# EAGLE design Tengu v10 (EAGLE 7.5.0)
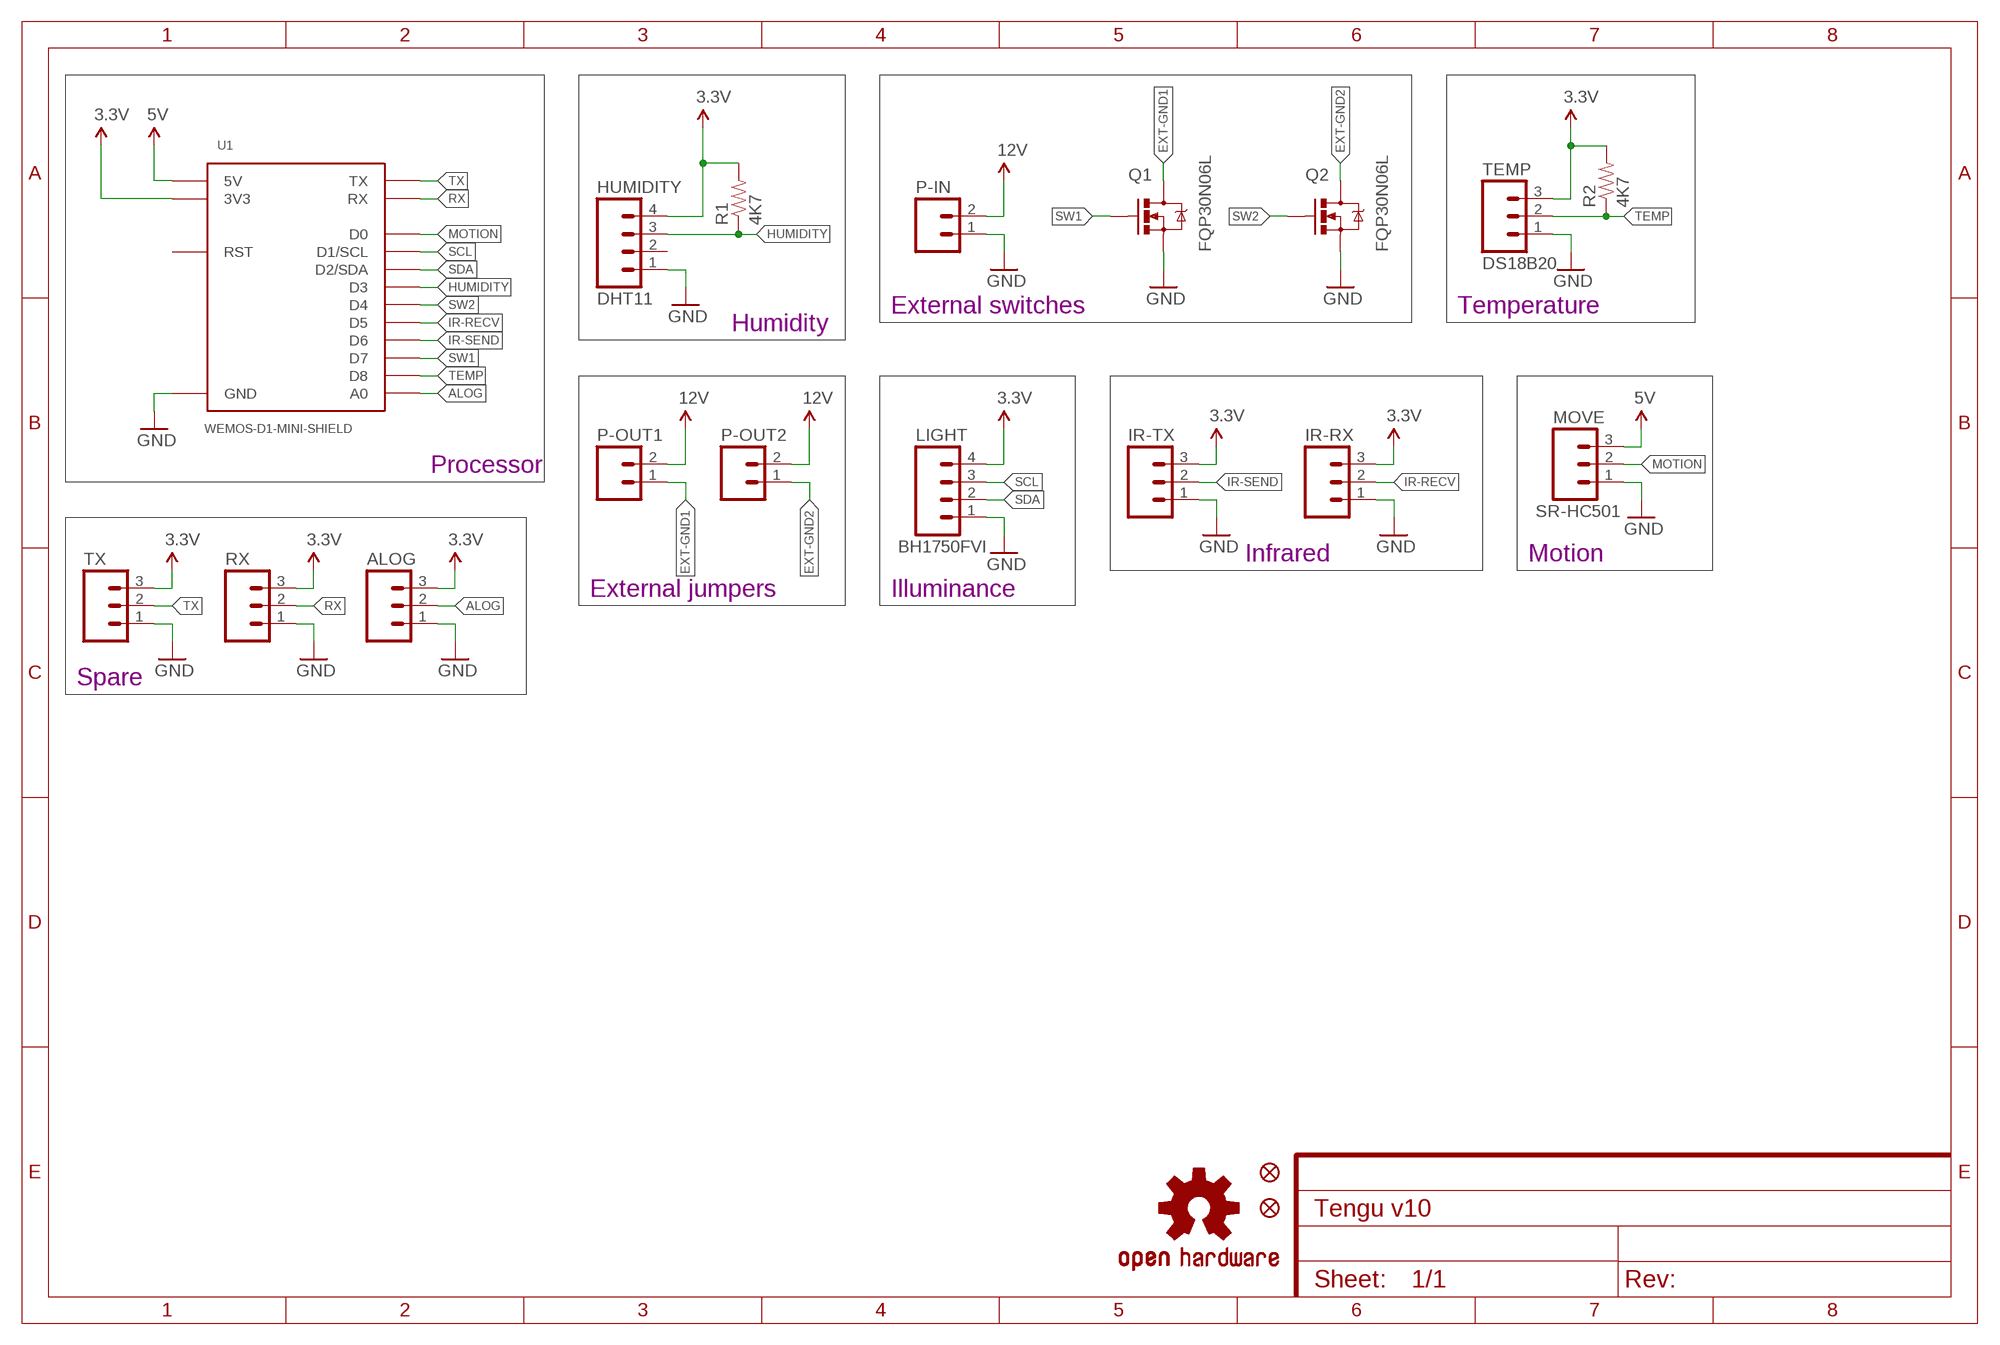
[diagram p0: schematic, sheet 1, part 1 of 2]
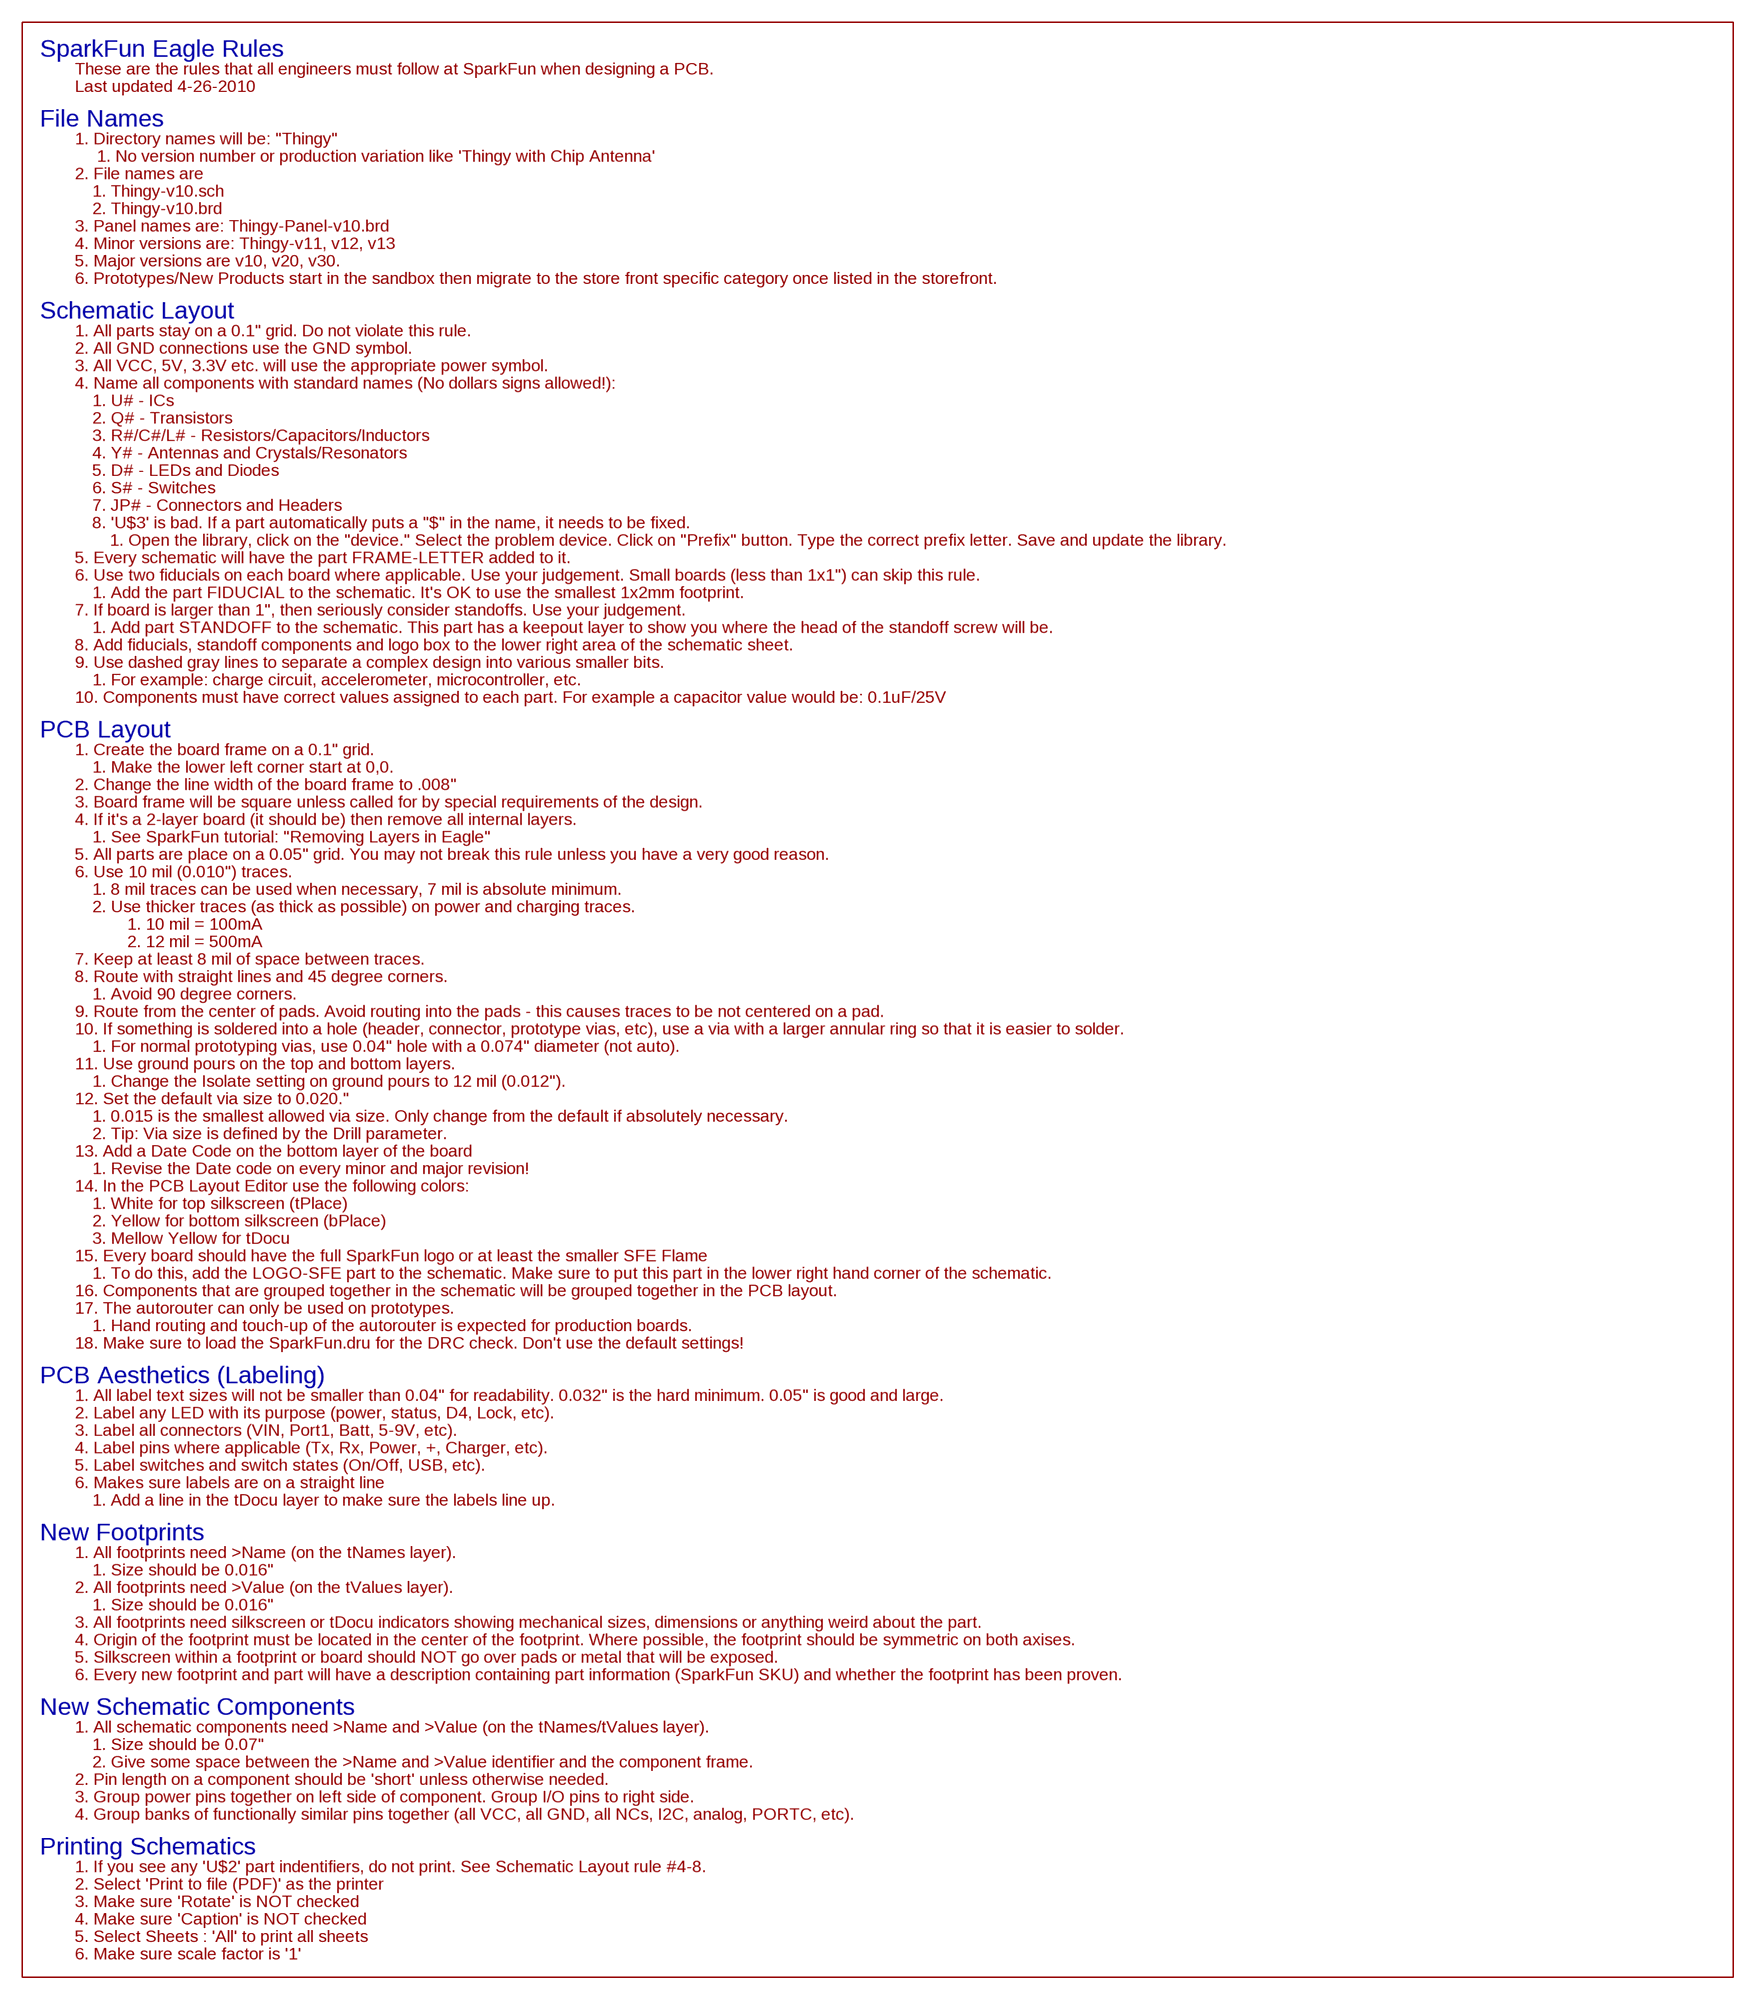
[diagram p1: schematic, sheet 1, part 2 of 2]

## Parts
ALOG  M03PTH  [1X03]
FD1  FIDUCIAL1X2  [FIDUCIAL-1X2]
FD2  FIDUCIAL1X2  [FIDUCIAL-1X2]
HUMIDITY  DHT11  M04PTH  [1X04]
IR-RX  M03PTH  [1X03]
IR-TX  M03PTH  [1X03]
LIGHT  BH1750FVI  M04PTH  [1X04]
LOGO1  OSHW-LOGOM  [OSHW-LOGO-M]
MOVE  SR-HC501  M03PTH  [1X03]
P-IN  M02PTH3  [1X02_LONGPADS]
P-OUT1  M02PTH3  [1X02_LONGPADS]
P-OUT2  M02PTH3  [1X02_LONGPADS]
Q1  FQP30N06L  MOSFET-NCHANNELFQP30N06L  [TO220V]
Q2  FQP30N06L  MOSFET-NCHANNELFQP30N06L  [TO220V]
R1  4K7  RESISTOR1206  [1206]
R2  4K7  RESISTOR1206  [1206]
RX  M03PTH  [1X03]
TEMP  DS18B20  M03PTH  [1X03]
TX  M03PTH  [1X03]
U1  WEMOS-D1-MINI-SHIELD  [WEMOS-D1-MINI-SHIELD]

## Nets
3.3V: ALOG.3 HUMIDITY.4 IR-RX.3 IR-TX.3 LIGHT.4 R1.2 R2.2 RX.3 TEMP.3 TX.3 U1.3V3
5V: MOVE.3 U1.5V
12V: P-IN.2 P-OUT1.2 P-OUT2.2
ALOG: ALOG.2 U1.A0
EXT-GND1: P-OUT1.1 Q1.2(D)
EXT-GND2: P-OUT2.1 Q2.2(D)
GND: ALOG.1 HUMIDITY.1 IR-RX.1 IR-TX.1 LIGHT.1 MOVE.1 P-IN.1 Q1.3(S) Q2.3(S) RX.1 TEMP.1 TX.1 U1.GND
HUMIDITY: HUMIDITY.3 R1.1 U1.D3
IR-RECV: IR-RX.2 U1.D5
IR-SEND: IR-TX.2 U1.D6
MOTION: MOVE.2 U1.D0
RX: RX.2 U1.RX
SCL: LIGHT.3 U1.D1(D1/SCL)
SDA: LIGHT.2 U1.D2(D2/SDA)
SW1: Q1.1(G) U1.D7
SW2: Q2.1(G) U1.D4
TEMP: R2.1 TEMP.2 U1.D8
TX: TX.2 U1.TX
Unconnected: HUMIDITY.2 U1.RST

## Notes on the sheet
- External switches | Temperature
- Humidity
- Processor
- Infrared | Motion
- External jumpers | Illuminance
- Spare

## Library data of the parts
ALOG IR-RX IR-TX MOVE RX TEMP TX = SparkFun-Connectors:M03: Header 3 Standard 3-pin 0.1" header. Use with straight break away headers (SKU : PRT-00116), right angle break away headers (PRT-00553), swiss pins (PRT-00743), machine pins (PRT-00117), and female headers (PRT-00115). Molex polarized connector foot print use with SKU : PRT-08232 with associated crimp pins and housings.
FD1 FD2 = SparkFun-Aesthetics:FIDUCIAL: Fiducial Alignment Points Various fiducial points for machine vision alignment.
HUMIDITY LIGHT = SparkFun-Connectors:M04: Header 4 Standard 4-pin 0.1" header. Use with straight break away headers (SKU : PRT-00116), right angle break away headers (PRT-00553), swiss pins (PRT-00743), machine pins (PRT-00117), and female headers (PRT-00115). Molex polarized connector foot print use with SKU : PRT-08231 with associated crimp pins and housings. 1MM SMD Version SKU: PRT-10208; PROD_ID: CONN-09696
LOGO1 = SparkFun-Aesthetics:OSHW-LOGO: Open Source Hardware Logo This logo indicates the piece of hardware it is found on incorporates a OSHW license and/or adheres to the definition of open source hardware found here: http://freedomdefined.org/OSHW
P-IN P-OUT1 P-OUT2 = SparkFun-Connectors:M02: Standard 2-pin 0.1" header. Use with - straight break away headers ( PRT-00116) - right angle break away headers (PRT-00553) - swiss pins (PRT-00743) - machine pins (PRT-00117) - female headers (PRT-00115) Molex polarized connector foot print use with: PRT-08233 with associated crimp pins and housings. 2.54_SCREWTERM for use with PRT-10571. 3.5mm Screw Terminal footprints for PRT-08084 5mm Screw Terminal footprints for use with PRT-08432
Q1 Q2 = SparkFun-DiscreteSemi:MOSFET-NCHANNEL: Common NMOSFET Parts MFG P/N Store ID Prod ID FDD8780 TRANS-09984 SI7820DN TRANS-11055 FDS6630A IC-08089 2N7002PW TRANS-11151 FQP30N06L COM-10213 TRANS-10060 BSS123LT1G TRANS-08345 BSS138 TRANS-00830 BS170 2N7000; PROD_ID: TRANS-10060
R1 R2 = SparkFun-Resistors:RESISTOR: Resistor Basic schematic elements and footprints for 0603, 1206, and PTH resistors.
U1 = WemosMini:WEMOS-D1-MINI-SHIELD

## Board
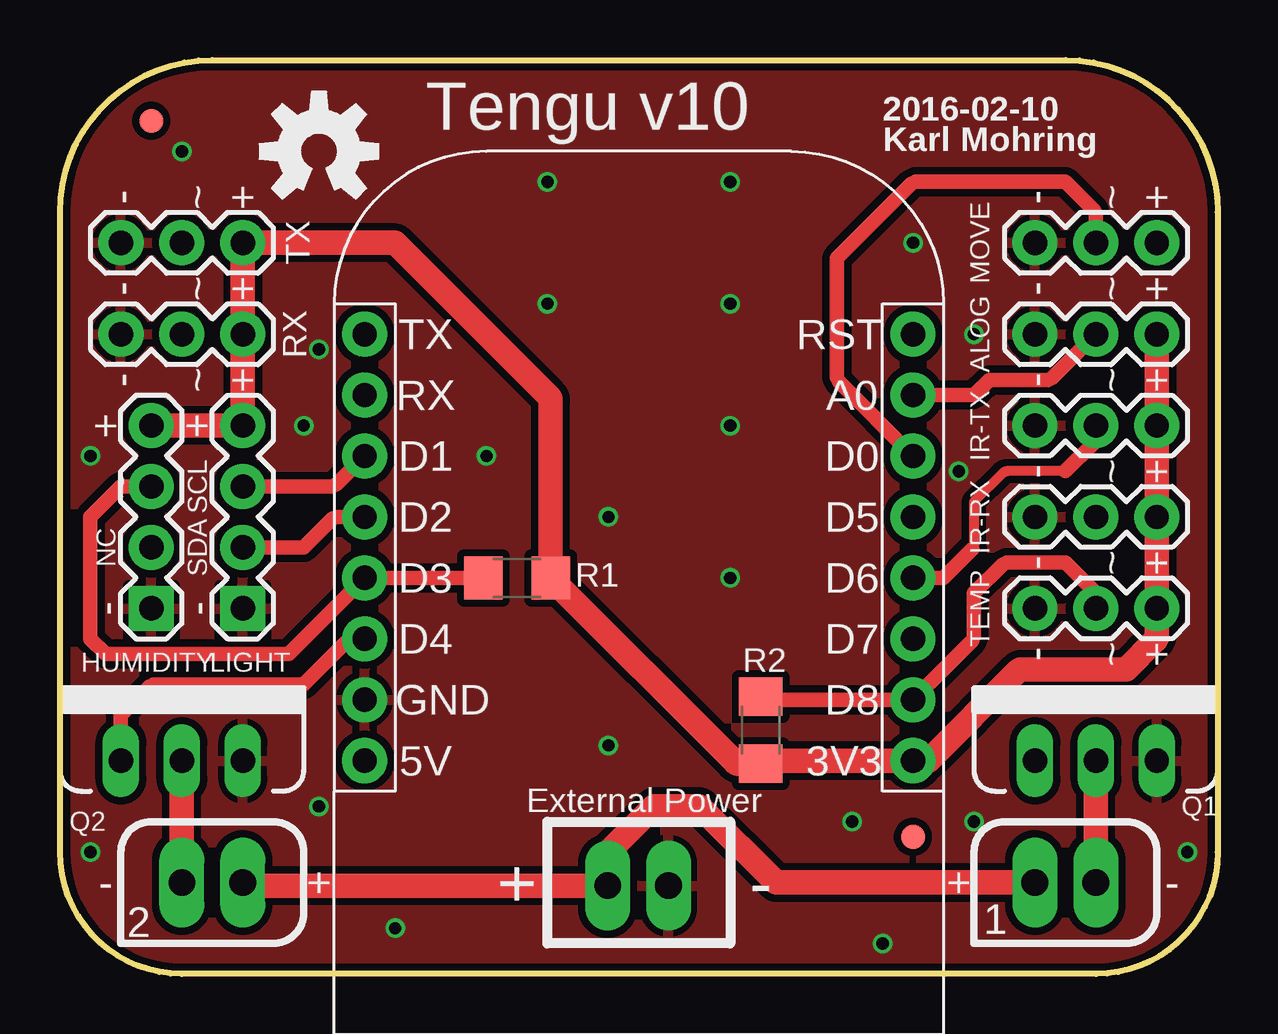
[diagram p2: board, top side]
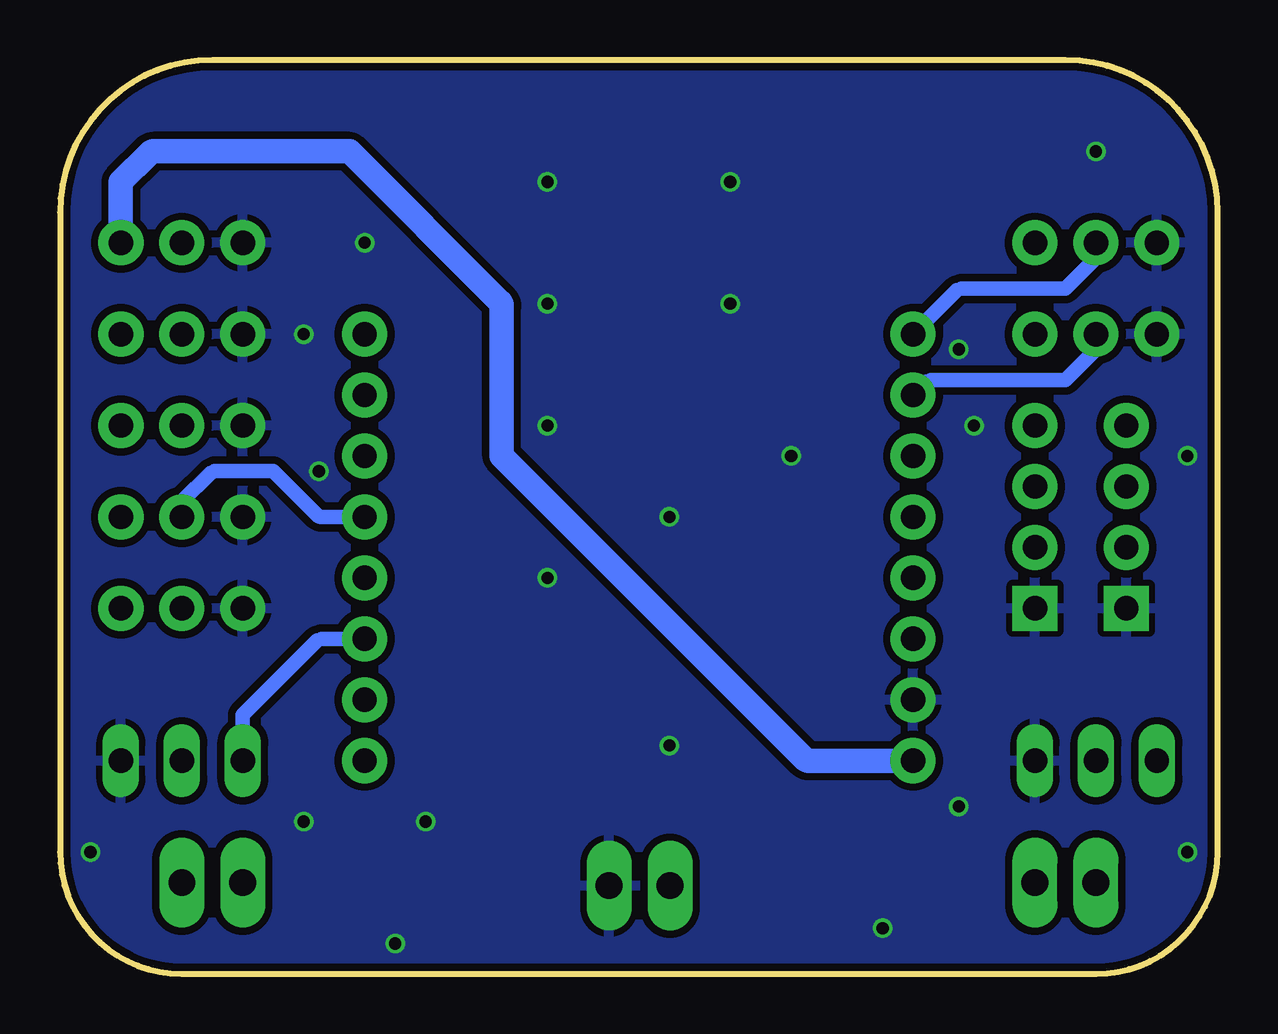
[diagram p3: board, bottom side, seen from below]

Size 48.26 x 38.1 mm. Coordinates in mm from the lower left corner, seen from the top.
Outline: 0,31.75 arc-90 6.35,38.1 41.91,38.1 arc-90 48.26,31.75 48.26,5.08 arc-90 43.18,0 5.08,0 arc-90 0,5.08 0,31.75
Copper layers (1*16): Top 0.035mm / dielectric 1.5mm / Bottom 0.035mm
Design rules "ITEADstudio_DRC": minimum track width 6mil, minimum drill 12mil, track to track 6mil, track to pad 6mil, pad to pad 6mil, via to via 6mil, smd to smd 0mil, copper to edge 10mil, drill to drill 10mil, minimum pad ring 10mil, minimum via ring 6mil, stop-mask expansion 2mil, vias tented up to drill 100mil, thermal gap 10mil

### Footprints (pad centres in the part's own frame; a part is rotated, then mirrored left to right if it is on the bottom)
1X03 = drill 1.016 pad 1.88: 1 0,0; 2 2.54,0; 3 5.08,0
FIDUCIAL-1X2 = smd 1 x 1: 1 0,0
1X04 = drill 1.016 pad 1.88 square: 1 0,0 | drill 1.016 pad 1.88: 2 2.54,0; 3 5.08,0; 4 7.62,0
1X02_LONGPADS = drill 1.118 pad 1.88 long: 1 0,0; 2 2.54,0
TO220V = drill 1.016 long: 1 -2.54,0; 2 0,0; 3 2.54,0
1206 = smd 1.6 x 1.8: 1 -1.4,0; 2 1.4,0
WEMOS-D1-MINI-SHIELD = drill 1.016 pad 1.88: 3V3 17.78,22.86; 5V 17.78,0; A0 2.54,22.86; D0 5.08,22.86; D1 5.08,0; D2 7.62,0; D3 10.16,0; D4 12.7,0; D5 7.62,22.86; D6 10.16,22.86; D7 12.7,22.86; D8 15.24,22.86; GND 15.24,0; RST 0,22.86; RX 2.54,0; TX 0,0

### Placement (x,y rotation side)
ALOG  40.64,26.67 0 top
FD1  3.81,35.56 0 top
FD2  35.56,5.71 0 top
HUMIDITY  3.81,15.24 90 top
IR-RX  40.64,19.05 0 top
IR-TX  40.64,22.86 0 top
LIGHT  7.62,15.24 90 top
LOGO1  10.79,34.29 0 top
MOVE  40.64,30.48 0 top
P-IN  25.37,3.68 180 top
P-OUT1  43.18,3.81 180 top
P-OUT2  5.08,3.81 0 top
Q1  43.18,8.89 0 top
Q2  5.08,8.89 0 top
R1  19.05,16.51 0 top
R2  29.21,10.16 270 top
RX  2.54,26.67 0 top
TEMP  40.64,15.24 0 top
TX  2.54,30.48 0 top
U1  12.7,26.67 270 top

### Tracks (layer width: path | path; a pad name or v marks a point on that pad's centre or on a via)
3.3V
  Top 1.016: ALOG.3 IR-TX.3 IR-RX.3 TEMP.3 45.72,14.07 arc-45 45.65,13.9 44.45,12.7 40.11,12.7 arc45 39.93,12.63 36.2,8.89 U1.3V3 29.45,8.89 arc45 29.27,8.82 R2.2 28.3,8.76 arc-45 28.13,8.83 R1.2 20.45,23.89 arc45 20.38,24.07 13.97,30.48 TX.3 RX.3 LIGHT.4 HUMIDITY.4
5V
  Bottom 1.016: U1.5V 17.04,8.89 arc45 17.22,8.96 29.84,21.59 29.84,27.84 arc-45 29.92,28.01 36.2,34.29 44.34,34.29 arc-45 44.52,34.22 45.72,33.02 MOVE.3
12V
  Top 1.016: P-OUT2.2 7.68,3.75 arc45 7.86,3.68 P-IN.2 22.83,4.95 arc-45 22.9,5.12 24.77,6.99 26.57,6.99 arc-45 26.74,6.91 29.84,3.81 P-OUT1.2
ALOG
  Top 0.406: 37.99,24.13 arc45 38.17,24.2 | 41.17,24.77 arc45 41.35,24.84
  Top 0.61: U1.A0 37.99,24.13 | 38.17,24.2 38.73,24.77 41.17,24.77 | 41.35,24.84 ALOG.2
EXT-GND1
  Top 1.016: P-OUT1.1 Q1.2
EXT-GND2
  Top 1.016: P-OUT2.1 Q2.2
GND  (via drill 0.51)
  other vias: 5.08,34.29 20.32,27.94 22.86,19.05 35.56,30.48 27.94,16.51 17.78,21.59 10.16,22.86 1.27,5.08 13.97,1.91 33.02,6.35 10.79,6.99 22.86,9.53 34.29,1.27 46.99,5.08 37.47,20.95 10.79,26.04 38.1,6.35 38.1,26.67 1.27,21.59 20.32,33.02 27.94,33.02 27.94,27.94 27.94,22.86
  pour Bottom (isolate 0.305): 0,0 0,31.75 arc-90 6.35,38.1 41.91,38.1 arc-90 48.26,31.75 48.26,5.08 arc-90 43.18,0
  pour Top (isolate 0.305): 0,11.43 0,38.1 41.91,38.1 arc-90 48.26,31.75 48.26,5.08 arc-90 43.18,0 5.08,0 arc-90 0,5.08
HUMIDITY
  Top 0.61: R1.1 U1.D3 9.53,13.34 1.91,13.34 1.27,13.97 1.27,19.05 2.54,20.32 HUMIDITY.3
IR-RECV
  Bottom 0.406: 41.8,20.95 arc-45 41.98,20.88
  Bottom 0.61: U1.D5 37.36,19.05 arc45 37.54,19.12 39.37,20.95 41.8,20.95 | 41.98,20.88 43.18,19.68 IR-RX.2
IR-SEND
  Top 0.406: 41.91,20.95 39.48,20.95 arc45 39.3,20.88 38.1,19.68 38.1,17.89 arc-45 38.03,17.71
  Top 0.61: IR-TX.2 43.18,22.33 arc-45 43.11,22.15 41.91,20.95 | 38.03,17.71 36.83,16.51 U1.D6
MOTION
  Top 0.406: 43.18,31.64 arc45 43.11,31.82 | 35.66,33.02 arc45 35.49,32.95 | 32.38,24.87 arc45 32.46,24.69
  Top 0.61: MOVE.2 43.18,31.64 | 43.11,31.82 41.91,33.02 35.66,33.02 | 35.49,32.95 32.38,29.84 32.38,24.87 | 32.46,24.69 U1.D0
RX
  Bottom 0.406: 5.08,26.14 arc45 5.15,25.96 | 11.96,24.77 arc-45 12.14,24.69
  Bottom 0.61: RX.2 5.08,26.14 | 5.15,25.96 6.35,24.77 11.96,24.77 | 12.14,24.69 U1.RX
SCL
  Top 0.406: 11.32,20.32 arc45 11.5,20.39
  Top 0.61: LIGHT.3 11.32,20.32 | 11.5,20.39 U1.D1
SDA
  Top 0.406: 11.54,19.05 arc45 11.36,18.98
  Top 0.61: U1.D2 11.54,19.05 | 11.36,18.98 10.16,17.78 LIGHT.2
SW1
  Bottom 0.406: 37.36,13.97 arc-45 37.54,13.9
  Bottom 0.61: U1.D7 37.36,13.97 | 37.54,13.9 40.64,10.79 Q1.1
SW2
  Top 0.406: U1.D4 12.17,13.97 arc45 11.99,13.9 | 3.92,12.06 arc45 3.74,11.99
  Top 0.61: 11.99,13.9 10.16,12.06 3.92,12.06 | 3.74,11.99 2.54,10.79 Q2.1
TEMP
  Top 0.406: 39.48,17.14 arc45 39.3,17.07 | 38.1,14.07 arc-45 38.03,13.9 | 29.45,11.43 arc-45 29.27,11.5 R2.1
  Top 0.61: TEMP.2 43.18,15.77 arc45 43.11,15.95 41.91,17.14 39.48,17.14 | 39.3,17.07 38.1,15.88 38.1,14.07 | 38.03,13.9 U1.D8 29.45,11.43
TX
  Bottom 0.406: 5.08,29.95 arc45 5.15,29.77 | 10.69,28.57 arc-45 10.87,28.5
  Bottom 0.61: TX.2 5.08,29.95 | 5.15,29.77 6.35,28.57 10.69,28.57 | 10.87,28.5 U1.TX

### Text on the board
tPlace: 2016-02-10 | Karl Mohring | - | ~ | + | - | ~ | + | - | ~ | + | - | ~ | + | - | ~ | + | - | ~ | + | + | + | - | ~ | + | ~ | SCL | NC | SDA | - | ~ | + | - | - | - | ~ | + | External Power | - | + | + | - | + | - | 2 | 1